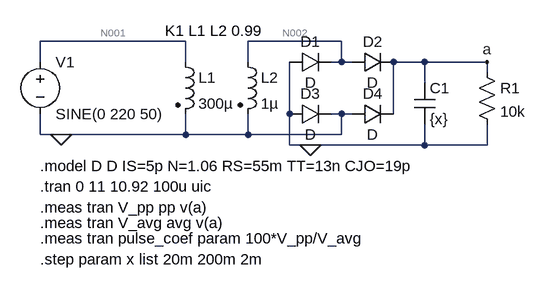
[diagram p0: schematic 2.4.asc]
2.4.asc, the LTspice schematic file:
Version 4
SHEET 1 1076 680
WIRE 320 80 96 80
WIRE 560 80 416 80
WIRE 96 112 96 80
WIRE 320 112 320 80
WIRE 416 112 416 80
WIRE 560 112 560 80
WIRE 560 112 544 112
WIRE 576 112 560 112
WIRE 688 112 640 112
WIRE 784 112 688 112
WIRE 784 128 784 112
WIRE 688 144 688 112
WIRE 480 192 480 112
WIRE 560 192 544 192
WIRE 576 192 560 192
WIRE 640 192 640 112
WIRE 96 224 96 192
WIRE 128 224 96 224
WIRE 320 224 320 192
WIRE 320 224 128 224
WIRE 416 224 416 192
WIRE 416 224 320 224
WIRE 560 224 560 192
WIRE 560 224 416 224
WIRE 480 240 480 192
WIRE 512 240 480 240
WIRE 688 240 688 208
WIRE 688 240 512 240
WIRE 784 240 784 208
WIRE 784 240 688 240
FLAG 128 224 0
FLAG 784 112 a
FLAG 512 240 0
SYMBOL voltage 96 96 R0
WINDOW 123 0 0 Left 0
WINDOW 39 0 0 Left 0
SYMATTR InstName V1
SYMATTR Value SINE(0 220 50)
SYMBOL ind2 304 96 R0
SYMATTR InstName L1
SYMATTR Value 300µ
SYMATTR SpiceLine Rser=10m
SYMATTR Type ind
SYMBOL ind2 400 96 R0
SYMATTR InstName L2
SYMATTR Value 1µ
SYMATTR SpiceLine Rser=10m
SYMATTR Type ind
SYMBOL cap 672 144 R0
SYMATTR InstName C1
SYMATTR Value {x}
SYMBOL res 768 112 R0
SYMATTR InstName R1
SYMATTR Value 10k
SYMBOL diode 480 128 R270
WINDOW 0 32 32 VTop 2
WINDOW 3 0 32 VBottom 2
SYMATTR InstName D1
SYMBOL diode 576 128 R270
WINDOW 0 32 32 VTop 2
WINDOW 3 0 32 VBottom 2
SYMATTR InstName D2
SYMBOL diode 480 208 R270
WINDOW 0 32 32 VTop 2
WINDOW 3 0 32 VBottom 2
SYMATTR InstName D3
SYMBOL diode 576 208 R270
WINDOW 0 32 32 VTop 2
WINDOW 3 0 32 VBottom 2
SYMATTR InstName D4
TEXT 96 272 Left 2 !.model D D IS=5p N=1.06 RS=55m TT=13n CJO=19p
TEXT 288 64 Left 2 !K1 L1 L2 0.99
TEXT 96 304 Left 2 !.tran 0 11 10.92 100u uic
TEXT 96 336 Left 2 !.meas tran V_pp pp v(a)
TEXT 96 360 Left 2 !.meas tran V_avg avg v(a)
TEXT 96 384 Left 2 !.meas tran pulse_coef param 100*V_pp/V_avg
TEXT 96 416 Left 2 !.step param x list 20m 200m 2m

The netlist it stands for:
* 2.4.asc
V1 N001 0 SINE(0 220 50)
L1 N001 0 300µ Rser=10m
L2 N002 0 1µ Rser=10m
C1 a 0 {x}
R1 a 0 10k
D1 0 N002 D
D2 N002 a D
D3 0 0 D
D4 0 a D
.model D D
.lib standard.dio
.model D D IS=5p N=1.06 RS=55m TT=13n CJO=19p
K1 L1 L2 0.99
.tran 0 11 10.92 100u uic
.meas tran V_pp pp v(a)
.meas tran V_avg avg v(a)
.meas tran pulse_coef param 100*V_pp/V_avg
.step param x list 20m 200m 2m
.backanno
.end

* Results of the author's LTspice run, read from the files saved beside the schematic
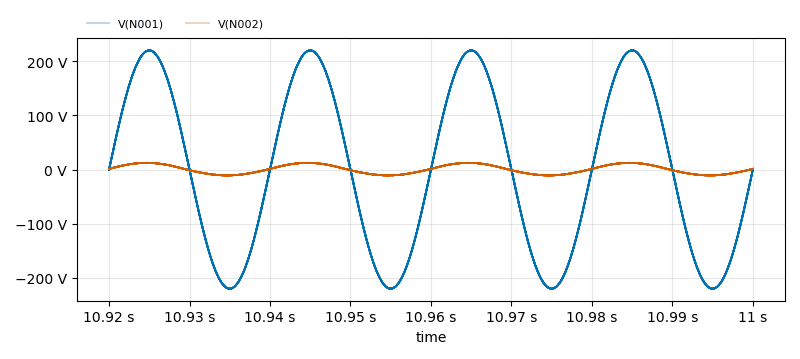
[diagram p1: Transient Analysis of 2.4.asc, plotted from the saved traces]
* Transient Analysis, 51 runs:
*   V(N001) [run 1]: min -219.9 V, max 220 V, average 26.29 mV, rms 155.6 V, last 0 V
*   V(N001) [run 2]: min -220 V, max 220 V, average 25.25 mV, rms 155.6 V, last 0 V
*   V(N001) [run 3]: min -219.9 V, max 220 V, average 26.5 mV, rms 155.6 V, last 0 V
*   V(N001) [run 4]: min -220 V, max 220 V, average 26.53 mV, rms 155.6 V, last 0 V
*   V(N001) [run 5]: min -220 V, max 220 V, average 25.19 mV, rms 155.6 V, last 0 V
*   V(N001) [run 6]: min -219.7 V, max 220 V, average 27.4 mV, rms 155.6 V, last 0 V
*   V(N001) [run 7]: min -220 V, max 220 V, average 26.08 mV, rms 155.6 V, last 0 V
*   V(N001) [run 8]: min -220 V, max 220 V, average 25.09 mV, rms 155.6 V, last 0 V
*   V(N002) [run 1]: min -10.7 V, max 12.5 V, average 549.9 mV, rms 8.241 V, last 1.317 V
*   V(N002) [run 2]: min -10.71 V, max 12.5 V, average 549.9 mV, rms 8.241 V, last 1.317 V
*   V(N002) [run 3]: min -10.7 V, max 12.5 V, average 549.9 mV, rms 8.241 V, last 1.317 V
*   V(N002) [run 4]: min -10.71 V, max 12.5 V, average 549.9 mV, rms 8.241 V, last 1.317 V
*   V(N002) [run 5]: min -10.71 V, max 12.5 V, average 549.9 mV, rms 8.241 V, last 1.317 V
*   V(N002) [run 6]: min -10.7 V, max 12.5 V, average 550 mV, rms 8.241 V, last 1.317 V
*   V(N002) [run 7]: min -10.71 V, max 12.5 V, average 549.9 mV, rms 8.241 V, last 1.317 V
*   V(N002) [run 8]: min -10.71 V, max 12.5 V, average 549.9 mV, rms 8.241 V, last 1.317 V
* From the log:
*   Measurement: v_pp
*     step  PP(v(a))  FROM  TO
*        1  0.000207901  0  0.08
*        2  0.000206947  0  0.08
*        3  0.000207901  0  0.08
*        4  0.000206947  0  0.08
*        5  0.000208855  0  0.08
*        6  0.000207901  0  0.08
*        7  0.000208855  0  0.08
*        8  0.000207901  0  0.08
*        9  0.000206947  0  0.08
*       10  0.000206947  0  0.08
*       11  0.000207901  0  0.08
*       12  0.000207901  0  0.08
*       13  0.000205994  0  0.08
*       14  0.000207901  0  0.08
*       15  0.000207901  0  0.08
*       16  0.000208855  0  0.08
*       17  0.000207901  0  0.08
*       18  0.000206947  0  0.08
*       19  0.000206947  0  0.08
*       20  0.000207901  0  0.08
*       21  0.000207901  0  0.08
*       22  0.000206947  0  0.08
*       23  0.000207901  0  0.08
*       24  0.000208855  0  0.08
*       25  0.000208855  0  0.08
*       26  0.000205994  0  0.08
*       27  0.000206947  0  0.08
*       28  0.000207901  0  0.08
*       29  0.000208855  0  0.08
*       30  0.000205994  0  0.08
*       31  0.000207901  0  0.08
*       32  0.000207901  0  0.08
*       33  0.000207901  0  0.08
*       34  0.000208855  0  0.08
*       35  0.000207901  0  0.08
*       36  0.000207901  0  0.08
*       37  0.00020504  0  0.08
*       38  0.000207901  0  0.08
*       39  0.000206947  0  0.08
*       40  0.000208855  0  0.08
*     ...
*   Measurement: v_avg
*     step  AVG(v(a))  FROM  TO
*        1  11.859  0  0.08
*        2  11.859  0  0.08
*        3  11.859  0  0.08
*        4  11.859  0  0.08
*        5  11.8589  0  0.08
*        6  11.8589  0  0.08
*        7  11.8589  0  0.08
*        8  11.8589  0  0.08
*        9  11.8589  0  0.08
*       10  11.8589  0  0.08
*       11  11.8588  0  0.08
*       12  11.8588  0  0.08
*       13  11.8589  0  0.08
*       14  11.8588  0  0.08
*       15  11.8588  0  0.08
*       16  11.8587  0  0.08
*       17  11.8588  0  0.08
*       18  11.8588  0  0.08
*       19  11.8588  0  0.08
*       20  11.8588  0  0.08
*       21  11.8587  0  0.08
*       22  11.8587  0  0.08
*       23  11.8587  0  0.08
*       24  11.8587  0  0.08
*       25  11.8587  0  0.08
*       26  11.8588  0  0.08
*       27  11.8587  0  0.08
*       28  11.8587  0  0.08
*       29  11.8586  0  0.08
*       30  11.8587  0  0.08
*       31  11.8586  0  0.08
*       32  11.8586  0  0.08
*       33  11.8586  0  0.08
*       34  11.8586  0  0.08
*       35  11.8586  0  0.08
*       36  11.8586  0  0.08
*       37  11.8587  0  0.08
*       38  11.8586  0  0.08
*       39  11.8585  0  0.08
*       40  11.8585  0  0.08
*     ...
*   Measurement: pulse_coef
*     step  100*v_pp/v_avg
*        1  0.00175311
*        2  0.00174507
*        3  0.00175311
*        4  0.00174507
*        5  0.00176116
*        6  0.00175312
*        7  0.00176117
*        8  0.00175312
*        9  0.00174508
*       10  0.00174508
*       11  0.00175313
*       12  0.00175313
*       13  0.00173704
*       14  0.00175313
*       15  0.00175313
*       16  0.00176119
*       17  0.00175314
*       18  0.00174509
*       19  0.00174509
*       20  0.00175314
*       21  0.00175315
*       22  0.0017451
*       23  0.00175315
*       24  0.0017612
*       25  0.0017612
*       26  0.00173706
*       27  0.00174511
*       28  0.00175315
*       29  0.0017612
*       30  0.00173707
*       31  0.00175317
*       32  0.00175317
*       33  0.00175317
*       34  0.00176122
*       35  0.00175317
*       36  0.00175317
*       37  0.00172903
*       38  0.00175317
*       39  0.00174513
*       40  0.00176123
*     ...